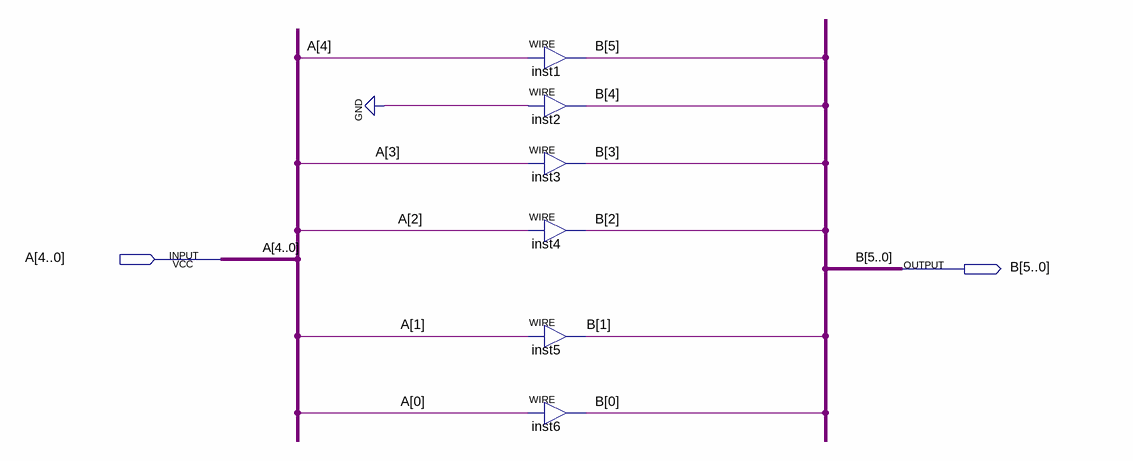
[diagram p0: schematic sheet]
// Quartus schematic bitp6.bdf as structural Verilog: 6 symbols, 2 pins
module bitp6 (
  input  [4:0] A,
  output [5:0] B
);

  assign B[5] = A[4];  // WIRE inst1
  assign B[4] = 1'b0;  // WIRE inst2
  assign B[3] = A[3];  // WIRE inst3
  assign B[2] = A[2];  // WIRE inst4
  assign B[1] = A[1];  // WIRE inst5
  assign B[0] = A[0];  // WIRE inst6
endmodule
